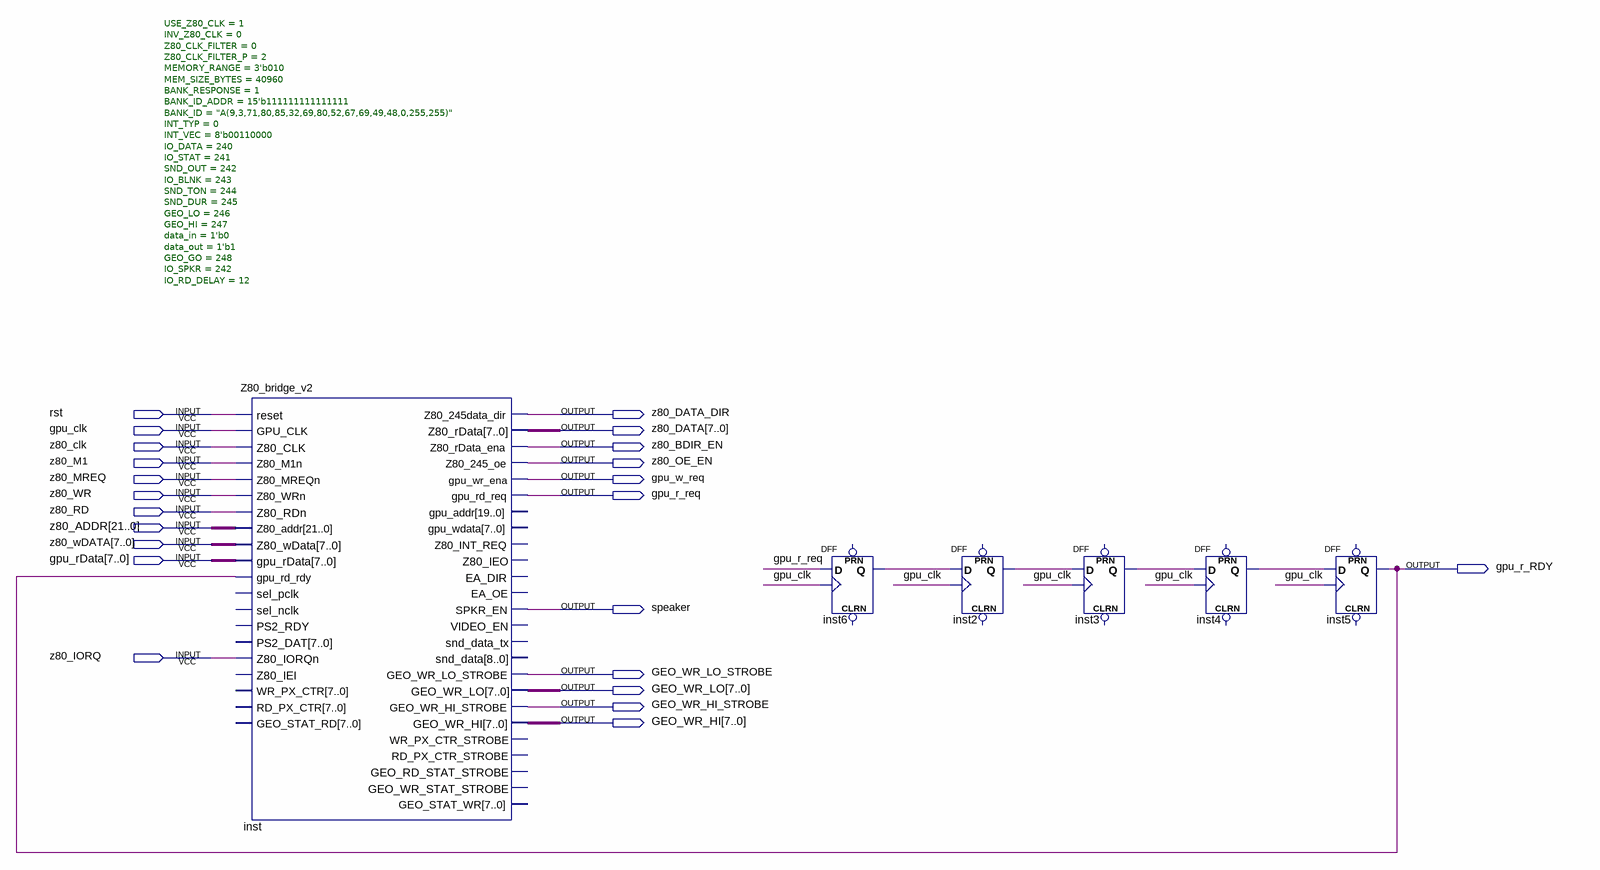
[diagram p0: schematic sheet]
// Quartus schematic Block1.bdf as structural Verilog: 6 symbols, 23 pins
module Block1 (
  input  rst,
  input  gpu_clk,
  input  z80_clk,
  input  z80_M1,
  input  z80_MREQ,
  input  z80_WR,
  input  z80_RD,
  input  [21:0] z80_ADDR,
  input  [7:0] z80_wDATA,
  input  [7:0] gpu_rData,
  input  z80_IORQ,
  output z80_DATA_DIR,
  output [7:0] z80_DATA,
  output z80_BDIR_EN,
  output z80_OE_EN,
  output gpu_w_req,
  output gpu_r_req,
  output gpu_r_RDY,
  output speaker,
  output GEO_WR_LO_STROBE,
  output [7:0] GEO_WR_LO,
  output GEO_WR_HI_STROBE,
  output [7:0] GEO_WR_HI
);

  wire inst2_q, inst3_q, inst4_q, inst6_q;

  Z80_bridge_v2 #(.USE_Z80_CLK(1), .INV_Z80_CLK(0), .Z80_CLK_FILTER(0), .Z80_CLK_FILTER_P(2), .MEMORY_RANGE(3'b010), .MEM_SIZE_BYTES(40960), .BANK_RESPONSE(1), .BANK_ID_ADDR(15'b111111111111111), .BANK_ID("A(9,3,71,80,85,32,69,80,52,67,69,49,48,0,255,255)"), .INT_TYP(0), .INT_VEC(8'b00110000), .IO_DATA(240), .IO_STAT(241), .SND_OUT(242), .IO_BLNK(243), .SND_TON(244), .SND_DUR(245), .GEO_LO(246), .GEO_HI(247), .data_in(1'b0), .data_out(1'b1), .GEO_GO(248), .IO_SPKR(242), .IO_RD_DELAY(12)) inst (
    .reset(rst), .GPU_CLK(gpu_clk), .Z80_CLK(z80_clk), .Z80_M1n(z80_M1), .Z80_MREQn(z80_MREQ),
    .Z80_WRn(z80_WR), .Z80_RDn(z80_RD), .Z80_addr(z80_ADDR), .Z80_wData(z80_wDATA), .gpu_rData(gpu_rData),
    .gpu_rd_rdy(gpu_r_RDY), .Z80_IORQn(z80_IORQ), .Z80_245data_dir(z80_DATA_DIR), .Z80_rData(z80_DATA),
    .Z80_rData_ena(z80_BDIR_EN), .Z80_245_oe(z80_OE_EN), .gpu_wr_ena(gpu_w_req), .gpu_rd_req(gpu_r_req),
    .SPKR_EN(speaker), .GEO_WR_LO_STROBE(GEO_WR_LO_STROBE), .GEO_WR_LO(GEO_WR_LO),
    .GEO_WR_HI_STROBE(GEO_WR_HI_STROBE), .GEO_WR_HI(GEO_WR_HI));  // open: sel_pclk, sel_nclk, PS2_RDY, PS2_DAT, Z80_IEI, WR_PX_CTR, RD_PX_CTR, GEO_STAT_RD, gpu_addr, gpu_wdata, Z80_INT_REQ, Z80_IEO, EA_DIR, EA_OE, VIDEO_EN, snd_data_tx, snd_data, WR_PX_CTR_STROBE, RD_PX_CTR_STROBE, GEO_RD_STAT_STROBE, GEO_WR_STAT_STROBE, GEO_STAT_WR
  DFF inst6 (.CLK(gpu_clk), .D(gpu_r_req), .Q(inst6_q));  // open: CLRN, PRN
  DFF inst2 (.CLK(gpu_clk), .D(inst6_q), .Q(inst2_q));  // open: CLRN, PRN
  DFF inst3 (.CLK(gpu_clk), .D(inst2_q), .Q(inst3_q));  // open: CLRN, PRN
  DFF inst4 (.CLK(gpu_clk), .D(inst3_q), .Q(inst4_q));  // open: CLRN, PRN
  DFF inst5 (.CLK(gpu_clk), .D(inst4_q), .Q(gpu_r_RDY));  // open: CLRN, PRN
endmodule
